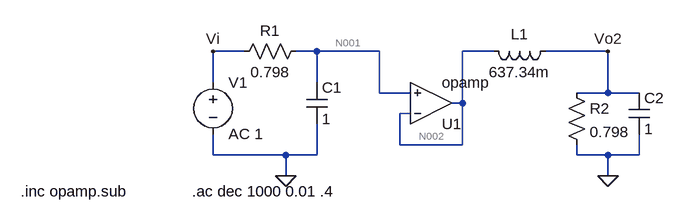
[diagram p0: schematic TS3NORMALIZADO.asc]
TS3NORMALIZADO.asc, the LTspice schematic file:
Version 4
SHEET 1 880 680
WIRE 0 80 -48 80
WIRE 112 80 80 80
WIRE 208 80 112 80
WIRE 384 80 336 80
WIRE 560 80 464 80
WIRE -48 128 -48 80
WIRE 112 128 112 80
WIRE 208 144 208 80
WIRE 256 144 208 144
WIRE 560 144 560 80
WIRE 560 144 512 144
WIRE 608 144 560 144
WIRE 336 160 336 80
WIRE 336 160 320 160
WIRE 256 176 240 176
WIRE 240 224 240 176
WIRE 336 224 336 160
WIRE 336 224 240 224
WIRE -48 240 -48 208
WIRE 64 240 -48 240
WIRE 112 240 112 192
WIRE 112 240 64 240
WIRE 512 240 512 224
WIRE 560 240 512 240
WIRE 608 240 608 208
WIRE 608 240 560 240
WIRE 64 272 64 240
WIRE 560 272 560 240
FLAG -48 80 Vi
FLAG 64 272 0
FLAG 560 272 0
FLAG 560 80 Vo2
SYMBOL res 96 64 R90
WINDOW 0 0 56 VBottom 2
WINDOW 3 32 56 VTop 2
SYMATTR InstName R1
SYMATTR Value 0.798
SYMBOL cap 96 128 R0
SYMATTR InstName C1
SYMATTR Value 1
SYMBOL voltage -48 112 R0
WINDOW 123 24 95 Left 2
WINDOW 39 0 0 Left 2
SYMATTR Value2 AC 1
SYMATTR InstName V1
SYMATTR Value ""
SYMBOL ind 480 64 R90
WINDOW 0 5 56 VBottom 2
WINDOW 3 32 56 VTop 2
SYMATTR InstName L1
SYMATTR Value 637.34m
SYMBOL res 496 128 R0
SYMATTR InstName R2
SYMATTR Value 0.798
SYMBOL cap 592 144 R0
SYMATTR InstName C2
SYMATTR Value 1
SYMBOL Opamps\\opamp 288 224 M180
SYMATTR InstName U1
TEXT -80 296 Left 2 !.ac dec 1000 0.01 .4
TEXT -344 296 Left 2 !.inc opamp.sub

The netlist it stands for:
* TS3NORMALIZADO.asc
R1 N001 Vi 0.798
C1 N001 0 1
V1 Vi 0 AC 1
L1 Vo2 N002 637.34m
R2 Vo2 0 0.798
C2 Vo2 0 1
XU1 N002 N001 N002 opamp Aol=100K GBW=10Meg  ; pins invin noninvin out
.ac dec 1000 0.01 .4
.inc opamp.sub
.backanno
.end

* Results of the author's LTspice run, read from the files saved beside the schematic
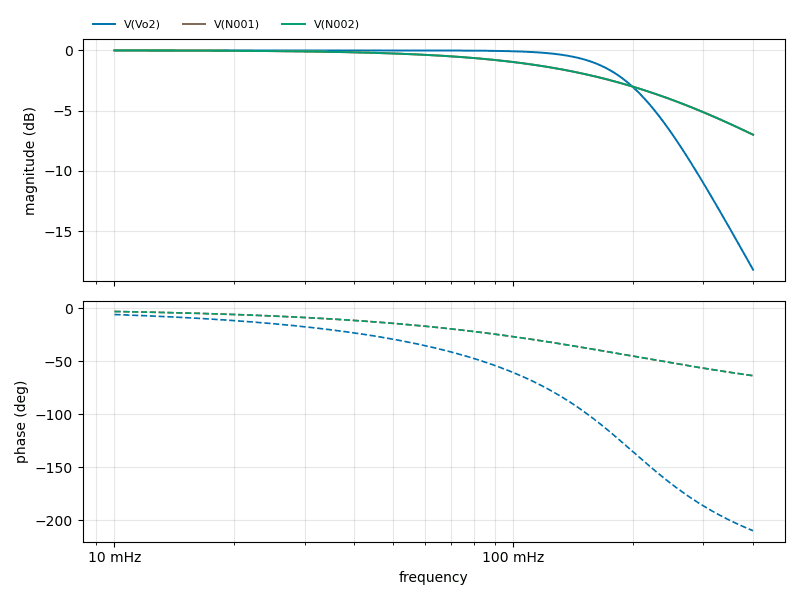
[diagram p1: AC Analysis of TS3NORMALIZADO.asc, plotted from the saved traces]
* AC Analysis, 1 run:
*   V(Vo2): -0.01 dB at 10 mHz, -18.21 dB at 400 mHz, peak -0.01 dB at 10 mHz, 3 dB below the peak at 199.3 mHz
*   V(N001): -0.01 dB at 10 mHz, -7.01 dB at 400 mHz, peak -0.01 dB at 10 mHz, 3 dB below the peak at 199.9 mHz
*   V(N002): -0.01 dB at 10 mHz, -7.01 dB at 400 mHz, peak -0.01 dB at 10 mHz, 3 dB below the peak at 199.9 mHz